# Altium schematic sheet mainboard.SchDoc
size 565 x 351 mm; Origin: Eagle
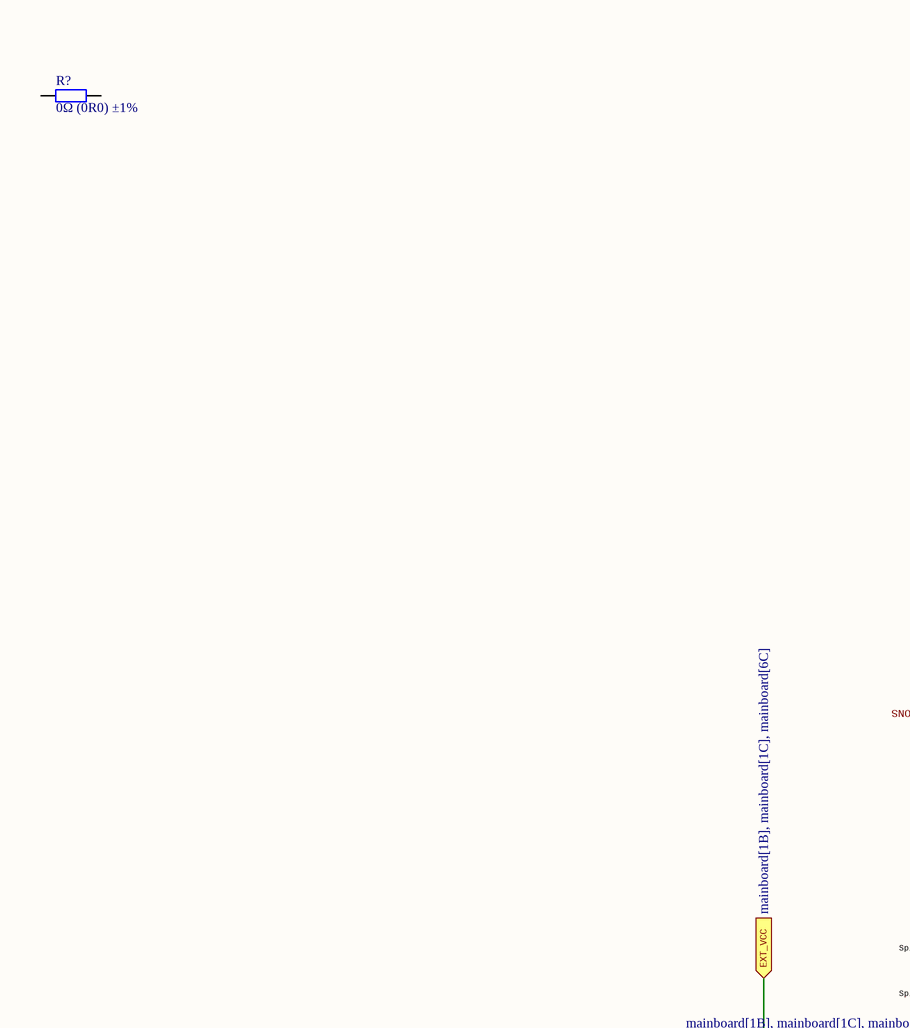
[diagram p0: mainboard.SchDoc, top left]
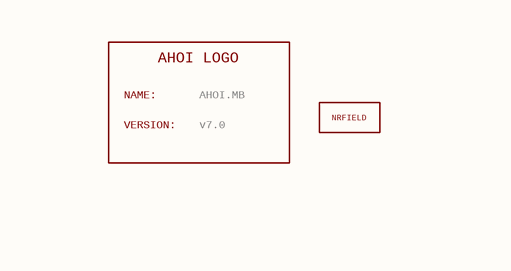
[diagram p1: mainboard.SchDoc, top middle]
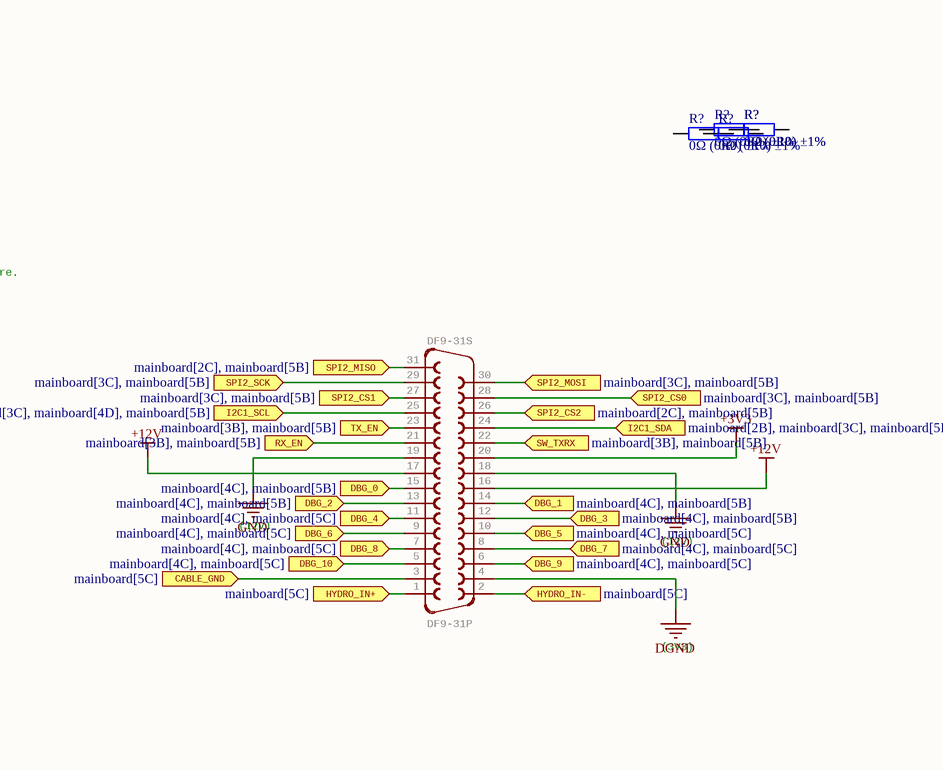
[diagram p2: mainboard.SchDoc, top right]
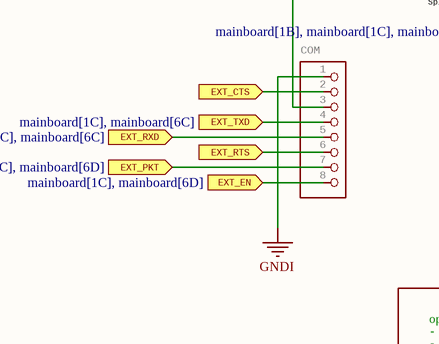
[diagram p3: mainboard.SchDoc, bottom left]
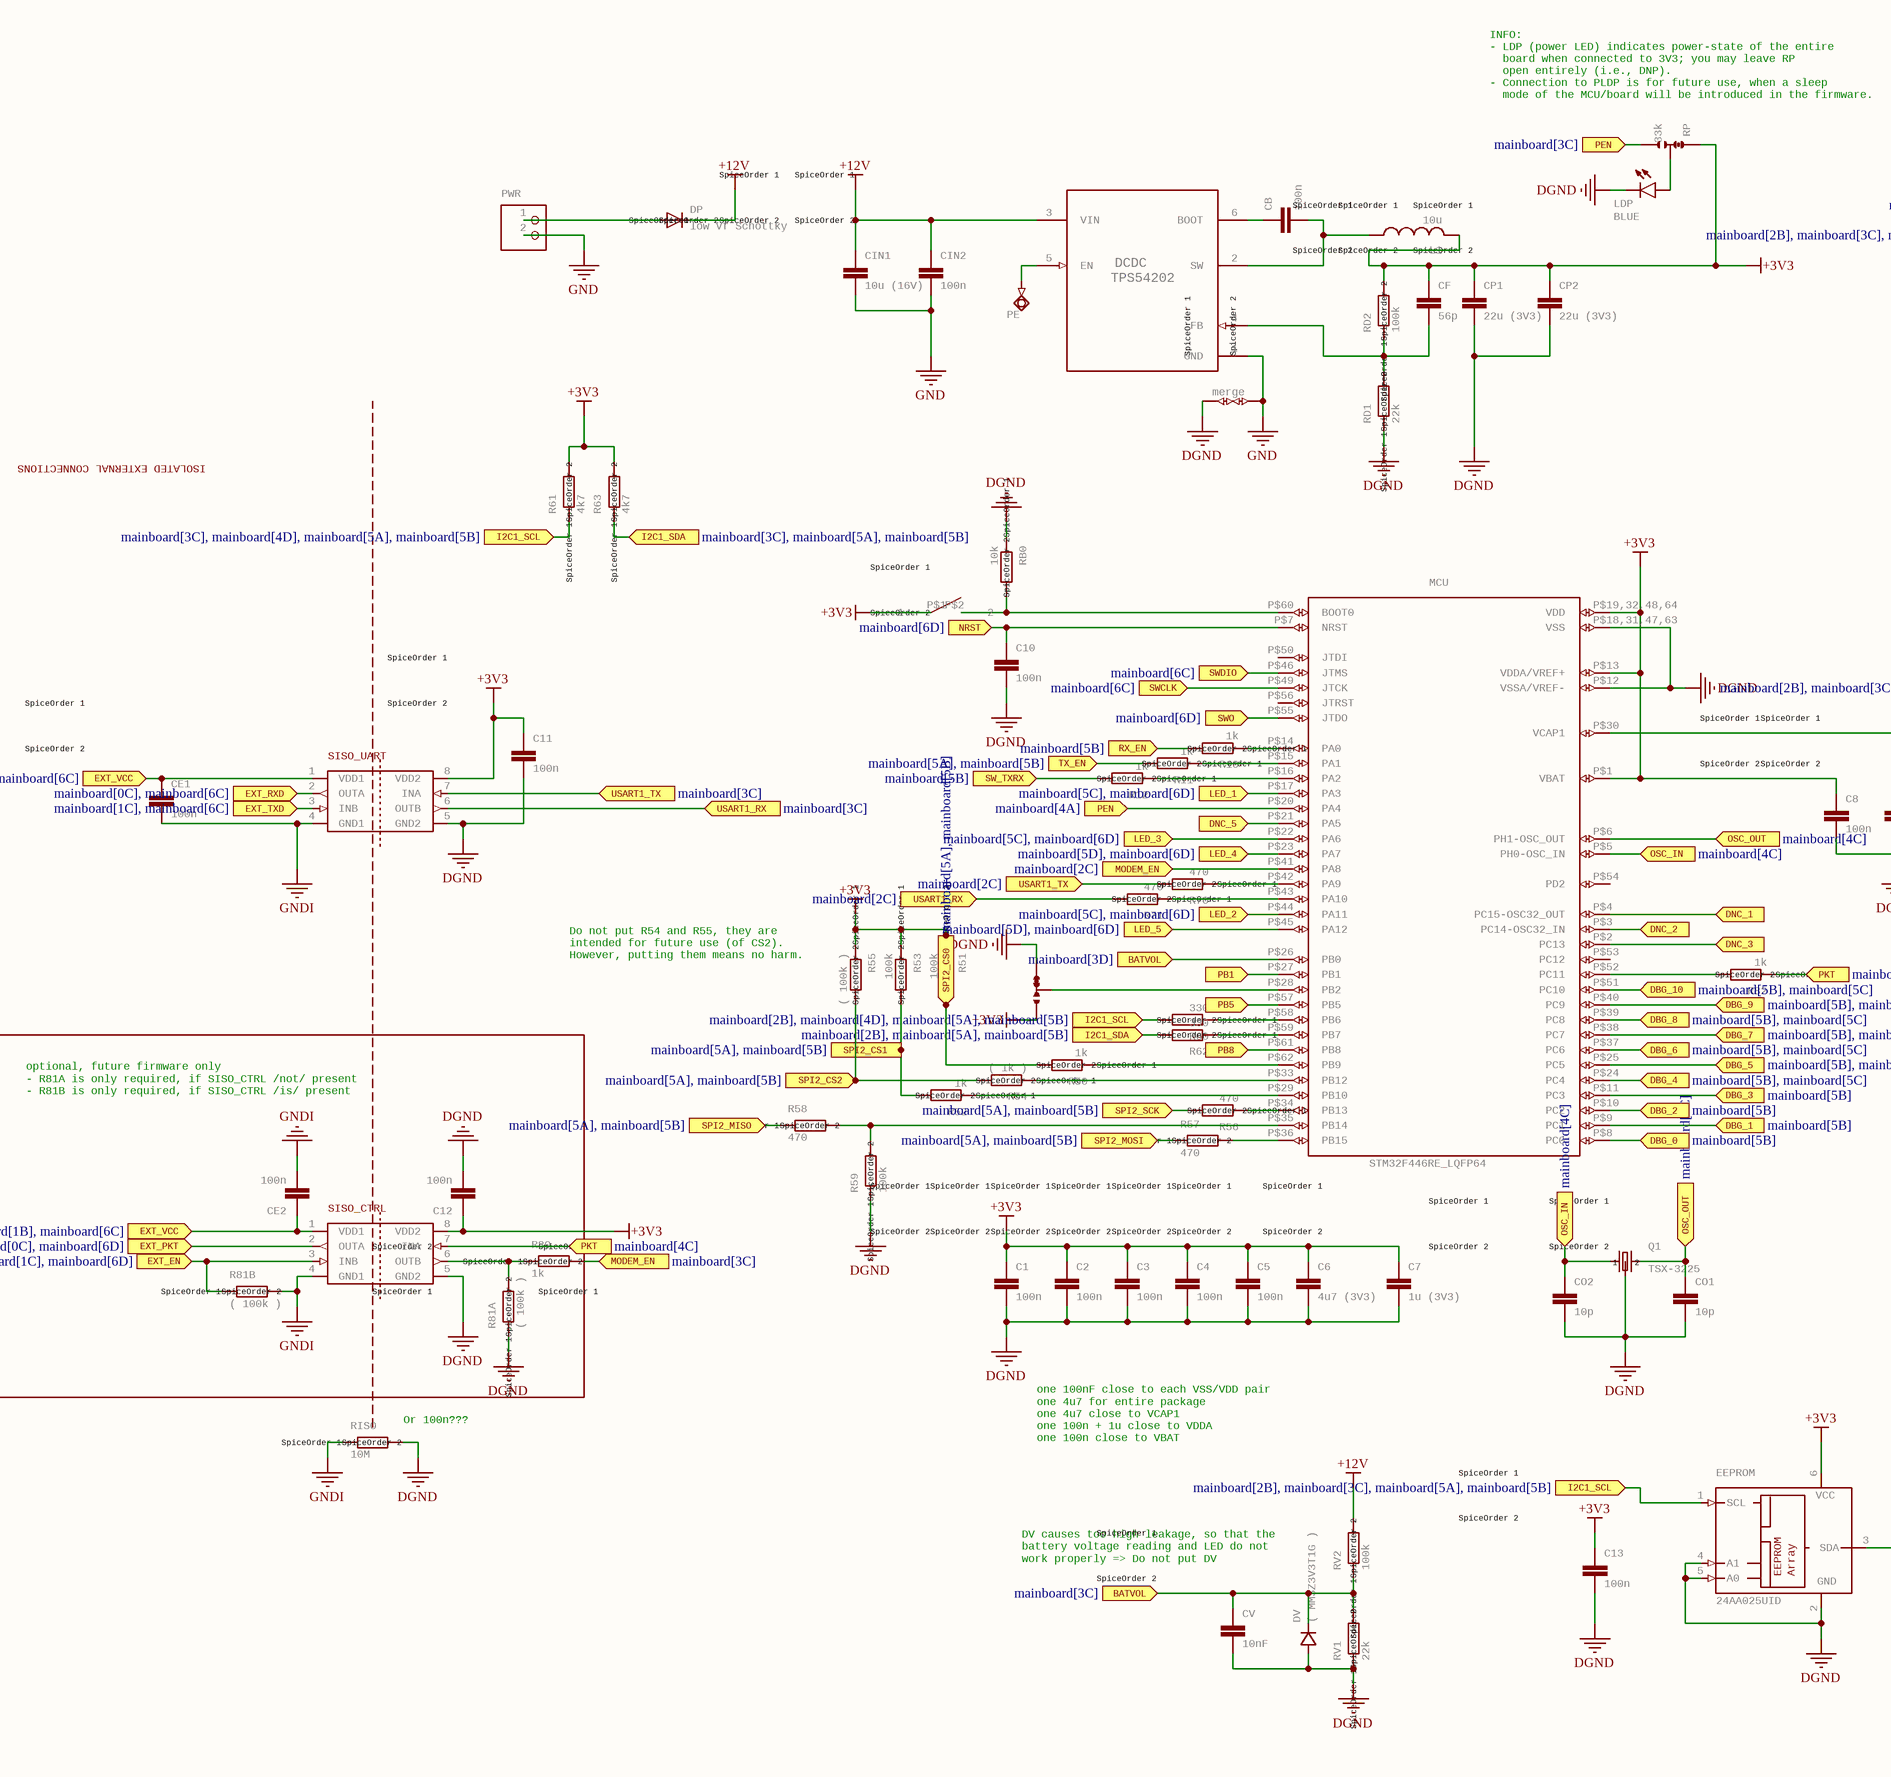
[diagram p4: mainboard.SchDoc, bottom middle]
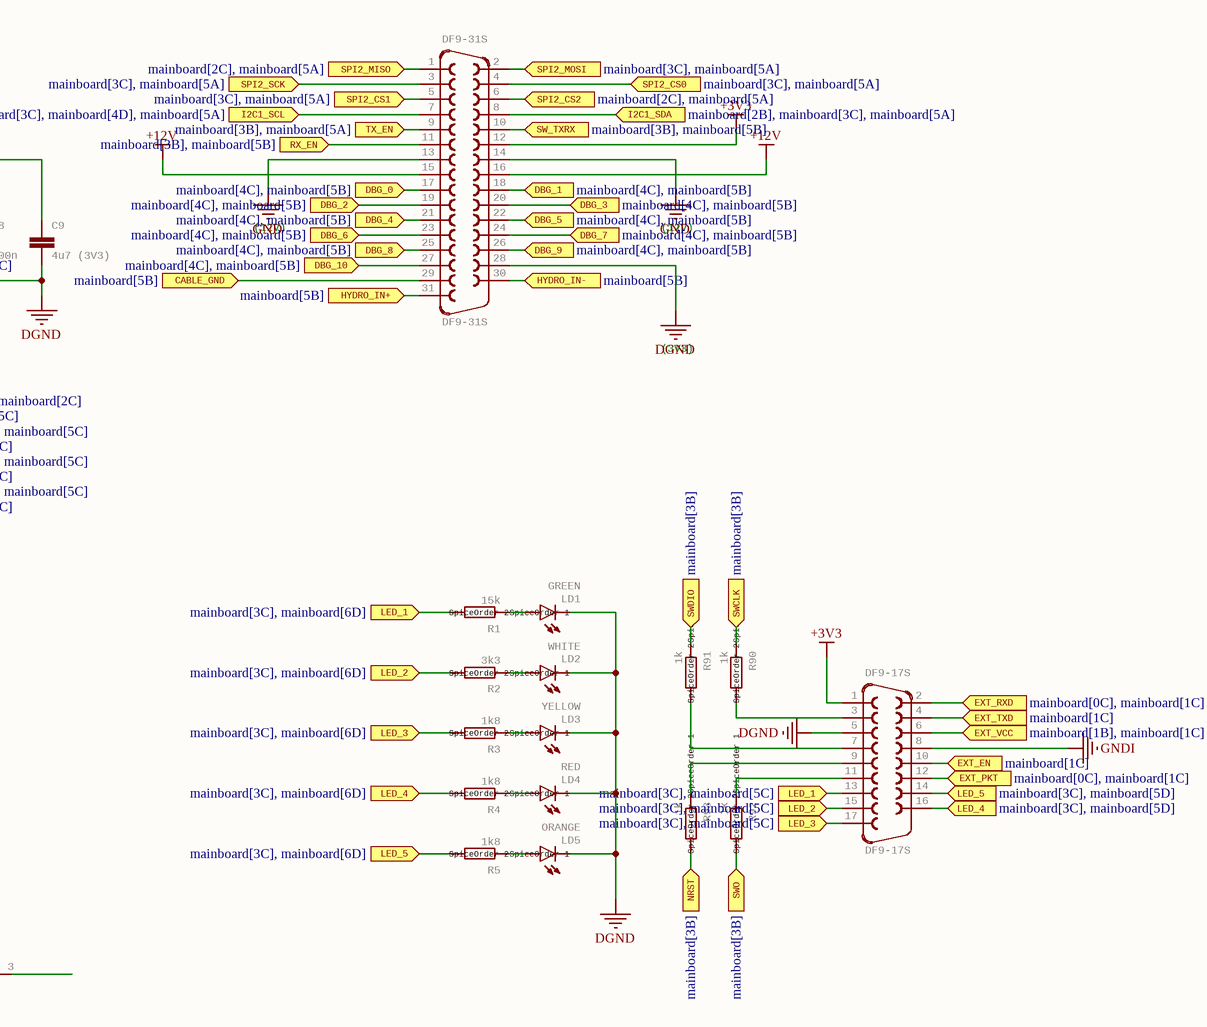
[diagram p5: mainboard.SchDoc, bottom right]

## Parts
(Parts that share a designator on the sheet are numbered #1, #2 ... from top to bottom, then left to right.)
AHOI.MB  v7.0  AHOILOGO: AHOI LOGO  NAME: NAME:  VERSION: VERSION:  [AHOI_LOGO_8MMHEIGHT]
C1  100n  SpiceOrder1: SpiceOrder 1  SpiceOrder2: SpiceOrder 2  [LC-0603_R]
C2  100n  SpiceOrder1: SpiceOrder 1  SpiceOrder2: SpiceOrder 2  [LC-0603_R]
C3  100n  SpiceOrder1: SpiceOrder 1  SpiceOrder2: SpiceOrder 2  [LC-0603_R]
C4  100n  SpiceOrder1: SpiceOrder 1  SpiceOrder2: SpiceOrder 2  [LC-0603_R]
C5  100n  SpiceOrder1: SpiceOrder 1  SpiceOrder2: SpiceOrder 2  [LC-0603_R]
C6  4u7 (3V3)  SpiceOrder1: SpiceOrder 1  SpiceOrder2: SpiceOrder 2  [LC-0805_R]
C7  1u (3V3)  SpiceOrder1: SpiceOrder 1  SpiceOrder2: SpiceOrder 2  [LC-0805_R]
C8  100n  SpiceOrder1: SpiceOrder 1  SpiceOrder2: SpiceOrder 2  [LC-0603_R]
C9  4u7 (3V3)  SpiceOrder1: SpiceOrder 1  SpiceOrder2: SpiceOrder 2  [LC-0805_R]
C10  100n  SpiceOrder1: SpiceOrder 1  SpiceOrder2: SpiceOrder 2  [LC-0603_R]
C11  100n  SpiceOrder1: SpiceOrder 1  SpiceOrder2: SpiceOrder 2  [LC-0603_R]
C12  100n  SpiceOrder1: SpiceOrder 1  SpiceOrder2: SpiceOrder 2  [LC-0603_R]
C13  100n  SpiceOrder1: SpiceOrder 1  SpiceOrder2: SpiceOrder 2  [LC-0603_R]
CB  100n  SpiceOrder1: SpiceOrder 1  SpiceOrder2: SpiceOrder 2  [LC-0603_R]
CE1  100n  SpiceOrder1: SpiceOrder 1  SpiceOrder2: SpiceOrder 2  [LC-0603_R]
CE2  100n  SpiceOrder1: SpiceOrder 1  SpiceOrder2: SpiceOrder 2  [LC-0603_R]
CF  56p  SpiceOrder1: SpiceOrder 1  SpiceOrder2: SpiceOrder 2  [LC-0603_R]
CIN1  10u (16V)  SpiceOrder1: SpiceOrder 1  SpiceOrder2: SpiceOrder 2  [LC-0805_R]
CIN2  100n  SpiceOrder1: SpiceOrder 1  SpiceOrder2: SpiceOrder 2  [LC-0603_R]
CO1  10p  SpiceOrder1: SpiceOrder 1  SpiceOrder2: SpiceOrder 2  [LC-0603_R]
CO2  10p  SpiceOrder1: SpiceOrder 1  SpiceOrder2: SpiceOrder 2  [LC-0603_R]
COM  PINHD-1X8  [1X08]  (value not drawn)
CP1  22u (3V3)  SpiceOrder1: SpiceOrder 1  SpiceOrder2: SpiceOrder 2  [LC-0805_R]
CP2  22u (3V3)  SpiceOrder1: SpiceOrder 1  SpiceOrder2: SpiceOrder 2  [LC-0805_R]
CV  10nF  SpiceOrder1: SpiceOrder 1  SpiceOrder2: SpiceOrder 2  [LC-0603_R]
DCDC  TPS54202  [LC-SOT-23-6]
DF9-17S  DF9-17S  [CONN-SMD_DF9-17S-1V-32]
DF9-31P  DF9-31S  [CONN-SMD_DF9-31S-1V]
DF9-31S  DF9-31S  [CONN-SMD_DF9-31S-1V]
DP  low Vf Schottky  SpiceOrder1: SpiceOrder 1  SpiceOrder2: SpiceOrder 2  [LC-SMA(DO-214AC)_S1]
DV  ( MM3Z3V3T1G )  [LC-SOD-323]
EEPROM  24AA025UID  [LC-SOT-23-6]
H-B1-L  0  [JMP_OR_0603]  (value not drawn)
L1  10u  [LC-SMD-3215_2P FC - 135]
LD1  GREEN  [LC-0603_LED_S1]
LD2  WHITE  [LC-0603_LED_S1]
LD3  YELLOW  [LC-0603_LED_S1]
LD4  RED  [LC-0603_LED_S1]
LD5  ORANGE  [LC-0603_LED_S1]
LDP  BLUE  [LC-0603_LED_S1]
MCU  STM32F446RE_LQFP64  [LC-LQFP-64_10x10x05P]
PE  TPSQTP06SQ  [TP06SQ]  (value not drawn)
PRG  TL3780  [SMD-SW-4_5.1x5.1x1.5]  (value not drawn)
PWR  PINHD-1X2  [1X02]  (value not drawn)
Q1  TSX-3225  [LC-SMD-3225_4P]
R1  15k  SpiceOrder1: SpiceOrder 1  SpiceOrder2: SpiceOrder 2  [LC-0603_R]
R2  3k3  SpiceOrder1: SpiceOrder 1  SpiceOrder2: SpiceOrder 2  [LC-0603_R]
R3  1k8  SpiceOrder1: SpiceOrder 1  SpiceOrder2: SpiceOrder 2  [LC-0603_R]
R4  1k8  SpiceOrder1: SpiceOrder 1  SpiceOrder2: SpiceOrder 2  [LC-0603_R]
R5  1k8  SpiceOrder1: SpiceOrder 1  SpiceOrder2: SpiceOrder 2  [LC-0603_R]
R10  1k  SpiceOrder1: SpiceOrder 1  SpiceOrder2: SpiceOrder 2  [LC-0603_R]
R11  1k  SpiceOrder1: SpiceOrder 1  SpiceOrder2: SpiceOrder 2  [LC-0603_R]
R12  1k  SpiceOrder1: SpiceOrder 1  SpiceOrder2: SpiceOrder 2  [LC-0603_R]
R50  1k  SpiceOrder1: SpiceOrder 1  SpiceOrder2: SpiceOrder 2  [LC-0603_R]
R51  100k  SpiceOrder1: SpiceOrder 1  SpiceOrder2: SpiceOrder 2  [LC-0603_R]
R52  1k  SpiceOrder1: SpiceOrder 1  SpiceOrder2: SpiceOrder 2  [LC-0603_R]
R53  100k  SpiceOrder1: SpiceOrder 1  SpiceOrder2: SpiceOrder 2  [LC-0603_R]
R54  ( 1k )  SpiceOrder1: SpiceOrder 1  SpiceOrder2: SpiceOrder 2  [LC-0603_R]
R55  ( 100k )  SpiceOrder1: SpiceOrder 1  SpiceOrder2: SpiceOrder 2  [LC-0603_R]
R56  470  SpiceOrder1: SpiceOrder 1  SpiceOrder2: SpiceOrder 2  [LC-0603_R]
R57  470  SpiceOrder1: SpiceOrder 1  SpiceOrder2: SpiceOrder 2  [LC-0603_R]
R58  470  SpiceOrder1: SpiceOrder 1  SpiceOrder2: SpiceOrder 2  [LC-0603_R]
R59  100k  SpiceOrder1: SpiceOrder 1  SpiceOrder2: SpiceOrder 2  [LC-0603_R]
R60  330  SpiceOrder1: SpiceOrder 1  SpiceOrder2: SpiceOrder 2  [LC-0603_R]
R61  4k7  SpiceOrder1: SpiceOrder 1  SpiceOrder2: SpiceOrder 2  [LC-0603_R]
R62  330  SpiceOrder1: SpiceOrder 1  SpiceOrder2: SpiceOrder 2  [LC-0603_R]
R63  4k7  SpiceOrder1: SpiceOrder 1  SpiceOrder2: SpiceOrder 2  [LC-0603_R]
R70  470  SpiceOrder1: SpiceOrder 1  SpiceOrder2: SpiceOrder 2  [LC-0603_R]
R71  470  SpiceOrder1: SpiceOrder 1  SpiceOrder2: SpiceOrder 2  [LC-0603_R]
R80  1k  SpiceOrder1: SpiceOrder 1  SpiceOrder2: SpiceOrder 2  [LC-0603_R]
R81A  ( 100k )  SpiceOrder1: SpiceOrder 1  SpiceOrder2: SpiceOrder 2  [LC-0603_R]
R81B  ( 100k )  SpiceOrder1: SpiceOrder 1  SpiceOrder2: SpiceOrder 2  [LC-0603_R]
R82  1k  SpiceOrder1: SpiceOrder 1  SpiceOrder2: SpiceOrder 2  [LC-0603_R]
R90  1k  SpiceOrder1: SpiceOrder 1  SpiceOrder2: SpiceOrder 2  [LC-0603_R]
R91  1k  SpiceOrder1: SpiceOrder 1  SpiceOrder2: SpiceOrder 2  [LC-0603_R]
R92  1k  SpiceOrder1: SpiceOrder 1  SpiceOrder2: SpiceOrder 2  [LC-0603_R]
R93  1k  SpiceOrder1: SpiceOrder 1  SpiceOrder2: SpiceOrder 2  [LC-0603_R]
R?#1  0Ω (0R0) ±1%  [0402_R]
R?#2  0Ω (0R0) ±1%  [0402_R]
R?#3  0Ω (0R0) ±1%  [0402_R]
R?#4  0Ω (0R0) ±1%  [0402_R]
R?#5  0Ω (0R0) ±1%  [0402_R]
R?#6  0Ω (0R0) ±1%  [0402_R]
RB0  10k  SpiceOrder1: SpiceOrder 1  SpiceOrder2: SpiceOrder 2  [LC-0603_R]
RD1  22k  SpiceOrder1: SpiceOrder 1  SpiceOrder2: SpiceOrder 2  [LC-0603_R]
RD2  100k  SpiceOrder1: SpiceOrder 1  SpiceOrder2: SpiceOrder 2  [LC-0603_R]
RISO  10M  SpiceOrder1: SpiceOrder 1  SpiceOrder2: SpiceOrder 2  [LC-0603_R]
RP  33k  [JMP_OR_0603]
RV1  22k  SpiceOrder1: SpiceOrder 1  SpiceOrder2: SpiceOrder 2  [LC-0603_R]
RV2  100k  SpiceOrder1: SpiceOrder 1  SpiceOrder2: SpiceOrder 2  [LC-0603_R]
SISO_CTRL  ISO7021F  [LC-SOP-8_150mil]  (value not drawn)
SISO_UART  ISO7021  [LC-SOP-8_150mil]  (value not drawn)
U$1  NR_FIELD  [NR_FIELD]  (value not drawn)
U$2  GND_MERGE  [GND_MERGE]  (value not drawn)

## Ports
BATVOL (in, see mainboard[3C]), BATVOL (in, see mainboard[3D]), CABLE_GND (in, see mainboard[5B]), CABLE_GND (in, see mainboard[5C]), DBG_0 (in, see mainboard[4C], mainboard[5B]), DBG_0 (in, see mainboard[5B]), DBG_1 (in, see mainboard[4C], mainboard[5B]), DBG_1 (in, see mainboard[5B]), DBG_2 (in, see mainboard[4C], mainboard[5B]), DBG_2 (in, see mainboard[5B]), DBG_3 (in, see mainboard[4C], mainboard[5B]), DBG_3 (in, see mainboard[5B]), DBG_4 (in, see mainboard[4C], mainboard[5B]), DBG_4 (in, see mainboard[4C], mainboard[5C]), DBG_4 (in, see mainboard[5B], mainboard[5C]), DBG_5 (in, see mainboard[4C], mainboard[5B]), DBG_5 (in, see mainboard[4C], mainboard[5C]), DBG_5 (in, see mainboard[5B], mainboard[5C]), DBG_6 (in, see mainboard[4C], mainboard[5B]), DBG_6 (in, see mainboard[4C], mainboard[5C]), DBG_6 (in, see mainboard[5B], mainboard[5C]), DBG_7 (in, see mainboard[4C], mainboard[5B]), DBG_7 (in, see mainboard[4C], mainboard[5C]), DBG_7 (in, see mainboard[5B], mainboard[5C]), DBG_8 (in, see mainboard[4C], mainboard[5B]), DBG_8 (in, see mainboard[4C], mainboard[5C]), DBG_8 (in, see mainboard[5B], mainboard[5C]), DBG_9 (in, see mainboard[4C], mainboard[5B]), DBG_9 (in, see mainboard[4C], mainboard[5C]), DBG_9 (in, see mainboard[5B], mainboard[5C]), DBG_10 (in, see mainboard[4C], mainboard[5B]), DBG_10 (in, see mainboard[4C], mainboard[5C]), DBG_10 (in, see mainboard[5B], mainboard[5C]), DNC_1 (in), DNC_2 (in), DNC_3 (in), DNC_5 (in), EXT_CTS (in), EXT_EN (in, see mainboard[1C]), EXT_EN (in, see mainboard[1C], mainboard[6D]), EXT_PKT (in, see mainboard[0C], mainboard[1C]), EXT_PKT (in, see mainboard[0C], mainboard[6D]), EXT_PKT (in, see mainboard[1C], mainboard[6D]), EXT_RTS (in), EXT_RXD (in, see mainboard[0C], mainboard[1C]), EXT_RXD (in, see mainboard[0C], mainboard[6C]), EXT_RXD (in, see mainboard[1C], mainboard[6C]), EXT_TXD (in, see mainboard[1C]), EXT_TXD (in, see mainboard[1C], mainboard[6C]), EXT_VCC (in, see mainboard[1B], mainboard[1C]), EXT_VCC (in, see mainboard[1B], mainboard[1C], mainboard[6C]), EXT_VCC (in, see mainboard[1B], mainboard[6C]), HYDRO_IN+ (in, see mainboard[5B]), HYDRO_IN+ (in, see mainboard[5C]), HYDRO_IN- (in, see mainboard[5B]), HYDRO_IN- (in, see mainboard[5C]), I2C1_SCL (in, see mainboard[2B], mainboard[3C], mainboard[4D], mainboard[5A]), I2C1_SCL (in, see mainboard[2B], mainboard[3C], mainboard[4D], mainboard[5B]), I2C1_SCL (in, see mainboard[2B], mainboard[3C], mainboard[5A], mainboard[5B]), I2C1_SCL (in, see mainboard[2B], mainboard[4D], mainboard[5A], mainboard[5B]), I2C1_SCL (in, see mainboard[3C], mainboard[4D], mainboard[5A], mainboard[5B]), I2C1_SDA (in, see mainboard[2B], mainboard[3C], mainboard[5A]), I2C1_SDA (in, see mainboard[2B], mainboard[3C], mainboard[5B]), I2C1_SDA (in, see mainboard[2B], mainboard[5A], mainboard[5B]), I2C1_SDA (in, see mainboard[3C], mainboard[5A], mainboard[5B]), LED_1 (in, see mainboard[3C], mainboard[5C]), LED_1 (in, see mainboard[3C], mainboard[6D]), LED_1 (in, see mainboard[5C], mainboard[6D]), LED_2 (in, see mainboard[3C], mainboard[5C]), LED_2 (in, see mainboard[3C], mainboard[6D]), LED_2 (in, see mainboard[5C], mainboard[6D]), LED_3 (in, see mainboard[3C], mainboard[5C]), LED_3 (in, see mainboard[3C], mainboard[6D]), LED_3 (in, see mainboard[5C], mainboard[6D]), LED_4 (in, see mainboard[3C], mainboard[5D]), LED_4 (in, see mainboard[3C], mainboard[6D]), LED_4 (in, see mainboard[5D], mainboard[6D]), LED_5 (in, see mainboard[3C], mainboard[5D]), LED_5 (in, see mainboard[3C], mainboard[6D]), LED_5 (in, see mainboard[5D], mainboard[6D]), MODEM_EN (in, see mainboard[2C]), MODEM_EN (in, see mainboard[3C]), NRST (in, see mainboard[3B]), NRST (in, see mainboard[6D]), OSC_IN (in, see mainboard[4C]), OSC_OUT (in, see mainboard[4C]), PB1 (in), PB5 (in), PB8 (in), PEN (in, see mainboard[3C]), PEN (in, see mainboard[4A]), PKT (in, see mainboard[2C]), PKT (in, see mainboard[4C]), RX_EN (in, see mainboard[3B], mainboard[5B]), RX_EN (in, see mainboard[5B]), SPI2_CS0 (in, see mainboard[3C], mainboard[5A]), SPI2_CS0 (in, see mainboard[3C], mainboard[5B]), SPI2_CS0 (in, see mainboard[5A], mainboard[5B]), SPI2_CS1 (in, see mainboard[3C], mainboard[5A]), SPI2_CS1 (in, see mainboard[3C], mainboard[5B]), SPI2_CS1 (in, see mainboard[5A], mainboard[5B]), SPI2_CS2 (in, see mainboard[2C], mainboard[5A]), SPI2_CS2 (in, see mainboard[2C], mainboard[5B]), SPI2_CS2 (in, see mainboard[5A], mainboard[5B]), SPI2_MISO (in, see mainboard[2C], mainboard[5A]), SPI2_MISO (in, see mainboard[2C], mainboard[5B]), SPI2_MISO (in, see mainboard[5A], mainboard[5B]), SPI2_MOSI (in, see mainboard[3C], mainboard[5A]), SPI2_MOSI (in, see mainboard[3C], mainboard[5B]), SPI2_MOSI (in, see mainboard[5A], mainboard[5B]), SPI2_SCK (in, see mainboard[3C], mainboard[5A]), SPI2_SCK (in, see mainboard[3C], mainboard[5B]), SPI2_SCK (in, see mainboard[5A], mainboard[5B]), SW_TXRX (in, see mainboard[3B], mainboard[5B]), SW_TXRX (in, see mainboard[5B]), SWCLK (in, see mainboard[3B]), SWCLK (in, see mainboard[6C]), SWDIO (in, see mainboard[3B]), SWDIO (in, see mainboard[6C]), SWO (in, see mainboard[3B]), SWO (in, see mainboard[6D]), TX_EN (in, see mainboard[3B], mainboard[5A]), TX_EN (in, see mainboard[3B], mainboard[5B]), TX_EN (in, see mainboard[5A], mainboard[5B]), USART1_RX (in, see mainboard[2C]), USART1_RX (in, see mainboard[3C]), USART1_TX (in, see mainboard[2C]), USART1_TX (in, see mainboard[3C])

## Nets
+3V3: C1.1 C2.1 C3.1 C4.1 C5.1 C6.1 C7.1 C8.1 C11.1 C12.1 C13.1 CF.1 CP1.1 CP2.1 DF9-17S.1 DF9-31P.20 DF9-31P.28 DF9-31S.4 DF9-31S.12 EEPROM.6(VCC) H-B1-L.3 L1.2 MCU.P$1(VBAT) MCU.P$13(VDDA/VREF+) MCU.P$19,32,48,64(VDD) PRG.P$1(1) R50.2 R51.1 R51.2 R53.1 R55.1 R61.2 R63.2 RD2.2 RP.1 SISO_CTRL.8(VDD2) SISO_UART.8(VDD2) ; port SPI2_CS0
+12V: CIN1.1 CIN2.1 DCDC.3(VIN) DF9-31P.16 DF9-31P.17 DF9-31S.15 DF9-31S.16 DP.C RV2.2
DGND: C1.2 C2.2 C3.2 C4.2 C5.2 C6.2 C7.2 C8.2 C9.2 C10.2 C11.2 C12.2 C13.2 CO1.2 CO2.2 CP1.2 CP2.2 CV.2 DF9-17S.5 DF9-31P.4 DF9-31S.28 DV.2(A) EEPROM.2(GND) EEPROM.4(A1) EEPROM.5(A0) H-B1-L.1 LD1.2(C) LD2.2(C) LD3.2(C) LD4.2(C) LD5.2(C) LDP.2(C) MCU.P$12(VSSA/VREF-) MCU.P$18,31,47,63(VSS) Q1.2,4(P$1) R59.1 R81A.1 RB0.1 RD1.1 RISO.2 RV1.1 SISO_CTRL.5(GND2) SISO_UART.5(GND2) U$2.P$1
GND: CIN1.2 CIN2.2 DCDC.1(GND) DF9-31P.18 DF9-31P.19 DF9-31S.13 DF9-31S.14 PWR.2 U$2.P$2
GNDI: CE1.2 CE2.2 COM.1 DF9-17S.8 R81B.2 RISO.1 SISO_CTRL.4(GND1) SISO_UART.4(GND1)
BATVOL: CV.1 DV.1(C) MCU.P$26(PB0) RV1.2 RV2.1 ; port BATVOL
CABLE_GND: DF9-31P.3 DF9-31S.29 ; port CABLE_GND
DBG_0: DF9-31P.15 DF9-31S.17 MCU.P$8(PC0) ; port DBG_0
DBG_1: DF9-31P.14 DF9-31S.18 MCU.P$9(PC1) ; port DBG_1
DBG_2: DF9-31P.13 DF9-31S.19 MCU.P$10(PC2) ; port DBG_2
DBG_3: DF9-31P.12 DF9-31S.20 MCU.P$11(PC3) ; port DBG_3
DBG_4: DF9-31P.11 DF9-31S.21 MCU.P$24(PC4) ; port DBG_4
DBG_5: DF9-31P.10 DF9-31S.22 MCU.P$25(PC5) ; port DBG_5
DBG_6: DF9-31P.9 DF9-31S.23 MCU.P$37(PC6) ; port DBG_6
DBG_7: DF9-31P.8 DF9-31S.24 MCU.P$38(PC7) ; port DBG_7
DBG_8: DF9-31P.7 DF9-31S.25 MCU.P$39(PC8) ; port DBG_8
DBG_9: DF9-31P.6 DF9-31S.26 MCU.P$40(PC9) ; port DBG_9
DBG_10: DF9-31P.5 DF9-31S.27 MCU.P$51(PC10) ; port DBG_10
DNC_1: MCU.P$4(PC15-OSC32_OUT) ; port DNC_1
DNC_2: MCU.P$3(PC14-OSC32_IN) ; port DNC_2
DNC_3: MCU.P$2(PC13) ; port DNC_3
DNC_5: MCU.P$21(PA5) ; port DNC_5
EXT_CTS: COM.2 ; port EXT_CTS
EXT_EN: COM.8 DF9-17S.10 R81B.1 SISO_CTRL.3(INB) ; port EXT_EN
EXT_PKT: COM.7 DF9-17S.12 SISO_CTRL.2(OUTA) ; port EXT_PKT
EXT_RTS: COM.6 ; port EXT_RTS
EXT_RXD: COM.5 DF9-17S.2 SISO_UART.2(OUTA) ; port EXT_RXD
EXT_TXD: COM.4 DF9-17S.4 SISO_UART.3(INB) ; port EXT_TXD
EXT_VCC: CE1.1 CE2.1 COM.3 DF9-17S.6 SISO_CTRL.1(VDD1) SISO_UART.1(VDD1) ; port EXT_VCC
HYDRO_IN+: DF9-31P.1 DF9-31S.31 ; port HYDRO_IN+
HYDRO_IN-: DF9-31P.2 DF9-31S.30 ; port HYDRO_IN-
I2C1_SCL: DF9-31P.25 DF9-31S.7 EEPROM.1(SCL) R60.2 R61.1 ; port I2C1_SCL
I2C1_SDA: DF9-31P.24 DF9-31S.8 R62.2 R63.1 ; port I2C1_SDA
LED_1: DF9-17S.13 MCU.P$17(PA3) R1.2 ; port LED_1
LED_2: DF9-17S.15 MCU.P$44(PA11) R2.2 ; port LED_2
LED_3: DF9-17S.17 MCU.P$22(PA6) R3.2 ; port LED_3
LED_4: DF9-17S.16 MCU.P$23(PA7) R4.2 ; port LED_4
LED_5: DF9-17S.14 MCU.P$45(PA12) R5.2 ; port LED_5
MODEM_EN: MCU.P$41(PA8) R80.2 ; port MODEM_EN
NRST: C10.1 MCU.P$7(NRST) R93.2 ; port NRST
OSC_IN: CO2.1 MCU.P$5(PH0-OSC_IN) Q1.1 ; port OSC_IN
OSC_OUT: CO1.1 MCU.P$6(PH1-OSC_OUT) Q1.3 ; port OSC_OUT
PB1: MCU.P$27(PB1) ; port PB1
PB5: MCU.P$57(PB5) ; port PB5
PB8: MCU.P$61(PB8) ; port PB8
PEN: MCU.P$20(PA4) RP.3 ; port PEN
PKT: R82.1 SISO_CTRL.7(INA) ; port PKT
RX_EN: DF9-31P.21 DF9-31S.11 R10.2 ; port RX_EN
SPI2_CS1: DF9-31P.27 DF9-31S.5 R52.2 R53.2 ; port SPI2_CS1
SPI2_CS2: DF9-31P.26 DF9-31S.6 R54.2 R55.2 ; port SPI2_CS2
SPI2_MISO: DF9-31P.31 DF9-31S.1 R58.1 ; port SPI2_MISO
SPI2_MOSI: DF9-31P.30 DF9-31S.2 R57.1 ; port SPI2_MOSI
SPI2_SCK: DF9-31P.29 DF9-31S.3 R56.2 ; port SPI2_SCK
SW_TXRX: DF9-31P.22 DF9-31S.10 R12.2 ; port SW_TXRX
SWCLK: MCU.P$49(JTCK) R90.1 ; port SWCLK
SWDIO: MCU.P$46(JTMS) R91.1 ; port SWDIO
SWO: MCU.P$55(JTDO) R92.2 ; port SWO
TX_EN: DF9-31P.23 DF9-31S.9 R11.2 ; port TX_EN
USART1_RX: R71.2 SISO_UART.6(OUTB) ; port USART1_RX
USART1_TX: R70.2 SISO_UART.7(INA) ; port USART1_TX
NetC9_1: C9.1 MCU.P$30(VCAP1)
NetCB_1: CB.1 DCDC.6(BOOT)
NetCB_2: CB.2 DCDC.2(SW) L1.1
NetCF_2: CF.2 DCDC.4(FB) RD1.2 RD2.1
NetDCDC_5: DCDC.5(EN) PE.TP
NetDF9-17S_3: DF9-17S.3 R90.2
NetDF9-17S_7: DF9-17S.7 R91.2
NetDF9-17S_9: DF9-17S.9 R93.1
NetDF9-17S_11: DF9-17S.11 R92.1
NetDP_A: DP.A PWR.1
NetH-B1-L_2: H-B1-L.2 MCU.P$28(PB2)
NetLD1_1: LD1.1(A) R1.1
NetLD2_1: LD2.1(A) R2.1
NetLD3_1: LD3.1(A) R3.1
NetLD4_1: LD4.1(A) R4.1
NetLD5_1: LD5.1(A) R5.1
NetLDP_1: LDP.1(A) RP.2
NetMCU_P$14: MCU.P$14(PA0) R10.1
NetMCU_P$15: MCU.P$15(PA1) R11.1
NetMCU_P$16: MCU.P$16(PA2) R12.1
NetMCU_P$29: MCU.P$29(PB10) R52.1
NetMCU_P$33: MCU.P$33(PB12) R54.1
NetMCU_P$34: MCU.P$34(PB13) R56.1
NetMCU_P$35: MCU.P$35(PB14) R58.2 R59.2
NetMCU_P$36: MCU.P$36(PB15) R57.2
NetMCU_P$42: MCU.P$42(PA9) R70.1
NetMCU_P$43: MCU.P$43(PA10) R71.1
NetMCU_P$52: MCU.P$52(PC11) R82.2
NetMCU_P$58: MCU.P$58(PB6) R60.1
NetMCU_P$59: MCU.P$59(PB7) R62.1
NetMCU_P$60: MCU.P$60(BOOT0) PRG.P$2(2) RB0.2
NetMCU_P$62: MCU.P$62(PB9) R50.1
NetR80_1: R80.1 R81A.2 SISO_CTRL.6(OUTB)
NetR?#3_1: R?#3.1 R?#4.1
NetR?#3_2: R?#3.2 R?#4.2

Not connected (* = marked no-connect by the designer): EEPROM 3(SDA); MCU P$50(JTDI) P$53(PC12) P$54(PD2) P$56(JTRST); R?#1 1 2; R?#2 1 2; R?#5 1 2; R?#6 1 2

## Notes on the sheet
- (near RP) INFO:
  - LDP (power LED) indicates power-state of the entire
  board when connected to 3V3; you may leave RP
  open entirely (i.e., DNP).
  - Connection to PLDP is for future use, when a sleep
  mode of the MCU/board will be introduced in the firmware.
- (12V)
- ISOLATED EXTERNAL CONNECTIONS
- (3V3)
- (near R55) Do not put R54 and R55, they are
  intended for future use (of CS2).
  However, putting them means no harm.
- optional, future firmware only
  - R81A is only required, if SISO_CTRL /not/ present
  - R81B is only required, if SISO_CTRL /is/ present
- (near RISO) Or 100n???
- one 100nF close to each VSS/VDD pair
  one 4u7 for entire package
  one 4u7 close to VCAP1
  one 100n + 1u close to VDDA
  one 100n close to VBAT
- (near RV2) DV causes too high leakage, so that the
  battery voltage reading and LED do not
  work properly => Do not put DV

## Library data of the parts
AHOI.MB = AHOI_LOGO: GateName_1: G$1; SymbolName_1: AHOI_LOGO; LibraryName: logo; DeviceSetName: AHOI_LOGO
C1-C5 C8 C10-C13 CB CE1 CE2 CF CIN2 CO1 CO2 CV = CC0603: GateName_1: G$1; SymbolName_1: C; DeviceName: C0603; LibraryName: myrcl; DeviceSetName: C
C6 C7 C9 CIN1 CP1 CP2 = CC0805: GateName_1: G$1; SymbolName_1: C; DeviceName: C0805; LibraryName: myrcl; DeviceSetName: C
COM = PINHD-1X8: PIN HEADER; GateName_1: A; SymbolName_1: PINHD8; POPULARITY: 67; LibraryName: pinhead; DeviceSetName: PINHD-1X8
DCDC = TPS54202: PARTNUMBER: TPS54202DDCR; GateName_1: A; SymbolName_1: TPS54202DDC; LibraryName: tps54202; DeviceSetName: TPS54202; MOUNTTYPE: SMT
DF9-17S = DF9-17S: GateName_1: G$1; SymbolName_1: DF9-17S; LibraryName: con-hirose; DeviceSetName: DF9-17S
DF9-31P DF9-31S = DF9-31S: SMD CONNECTOR   Source: con-hirose.lbr from Bob Starr <rtzaudio@mindspring.com>; MPN: DF9-31S-1V(32); GateName_1: DF9; SymbolName_1: DF9-31S; LibraryName: con-hirose; DeviceSetName: DF9-31S; MF: MF; OC_FARNELL: 1798382; OC_NEWARK: 74R3383
DP = DIODE-DO-214AC: DIODE; GateName_1: G$1; SymbolName_1: D; DeviceSetName: DIODE-; DeviceName: DO-214AC; LibraryName: diode
DV = DSOD323: DIODE; MPN: CDSOD323-T05C; GateName_1: G$1; DeviceName: SOD323; DeviceSetName: D; POPULARITY: 0; SymbolName_1: DIODE; LibraryName: zetex; MF: MF; OC_FARNELL: 1824860; OC_NEWARK: 79R6078
EEPROM = 24AA025UID: GateName_1: G$1; SymbolName_1: 24AA; LibraryName: 24AA02UID; DeviceSetName: 24AA025UID; Array: Array; VCC: VCC; GND: GND; EEPROM: EEPROM
H-B1-L RP = JMP_0603S: GateName_1: G$1; SymbolName_1: JMP_OR; DeviceName: S; LibraryName: jmp-or-0603; DeviceSetName: JMP_0603
L1 = VLCF5028-2: GateName_1: G$1; SymbolName_1: L-US; LibraryName: VLCF5028; DeviceSetName: VLCF5028-2
LD1-LD5 LDP = LED0603: GateName_1: G$1; SymbolName_1: LED; LibraryName: myrcl; DeviceSetName: LED0603
MCU = STM32F446RE_LQFP64: pin to pad: P$18,31,47,63>P$18+31+47+63 P$19,32,48,64>P$19+32+48+64; GateName_1: G$1; SymbolName_1: STM32F446RE; LibraryName: stm32f446re; DeviceSetName: STM32F446RE_LQFP64
PE = TPSQTP06SQ: Test pad; GateName_1: G$1; SymbolName_1: PPAD; DeviceSetName: TPSQ; POPULARITY: 0; DeviceName: TP06SQ; LibraryName: testpad
PRG = TL3780: GateName_1: G$1; SymbolName_1: BUTTON; LibraryName: switch-tl3780; DeviceSetName: TL3780
PWR = PINHD-1X2: PIN HEADER; GateName_1: G$1; SymbolName_1: PINHD2; LibraryName: pinhead; DeviceSetName: PINHD-1X2
Q1 = KX-7: Quartz Crystals (MHz) SMD: KX - Serie                  	                 Model    	          Size l/w/h [mm]    	          Frequency Range    	          Frequency       Stability    	          Temp. Range [掳C]     	          Load       Capacitance    	          AECQ 200       availabel    	          Datasheet    	                 KX-4       KX-5       KX-6       KX-7       KX-9A       KX-9B       KX-12A       KX-12B       KX-13       KX-20       KX-K       KX-KS      	          1.6/1.2/0.3       2.0/1.6/0.45       2.5/2.0/0.55       3.2/2.5/0.8       5.0/3.2/1.0        5.0/3.2/1.1        6.0/3.5/1.1        6.0/3.5/1.0        7.0/5.0 /1.3        11.6/5.5/1.6        12.3/4.5/4.2        12.3/4.5/3.2      	          24.0 ~ 80.0 MHz       16.0 ~ 80.0 MHz       12.0 ~ 80.0 MHz       8.0 ~ 60.0 MHz       7,68 ~ 300,0 MHz       8,0 ~ 50,0 MHz       8,0 ~ 150,0 MHz       8,0 ~ 50,0 MHz       6,0 ~ 160,0 MHz       3,579 ~ 25,0 MHz       3,579 ~ 70,0 MHz       3,579 ~ 70,0 MHz     	          卤10 鈥?卤50ppm       卤10 鈥?卤50ppm       卤10 鈥?卤50ppm       卤10 鈥?卤50ppm       卤10 鈥?卤50ppm       卤10 鈥?卤50ppm       卤10 鈥?卤50ppm       卤10 鈥?卤50ppm       卤10 鈥?卤50ppm       卤50ppm       卤10 鈥?卤50ppm       卤10 鈥?卤50ppm     	         (*) -40掳C 鈥?85掳C      (*) -40掳C 鈥?125掳C      (*) -40掳C 鈥?125掳C      (*) -40掳C 鈥?125掳C      (*) -40掳C 鈥?105掳C      (*) -40掳C 鈥?105掳C      (*) -40掳C 鈥?125掳C      (*) -40掳C 鈥?105掳C      (*) -40掳C 鈥?105掳C      (*) -40掳C 鈥?105掳C      (*) -40掳C 鈥?85掳C      (*) -40掳C 鈥?85掳C     	          8, 8鈥?6       8, 8鈥?6       10, 8鈥?6       12, 7鈥?0       16, 10鈥?0       16, 10鈥?0       16, 10鈥?0       16, 12鈥?0       16, 12鈥?0       16, 12鈥?0       16, 12鈥?0       16, 12鈥?0     	         -      yes       yes     yes       -       -       -       -       -       -       -       -     	          KX-4.pdf       KX-5.pdf       KX-6.pdf       KX-7.pdf       KX-9A.pdf       KX-9B.pdf       KX-12A.pdf       KX-12B.pdf       KX-13.pdf       KX-20.pdf       KX-K.pdf       KX-KS.pdf     	  	       Details see: http://www.geyer-electronic.de/Frequenz-Produkte.9.0.html   Created 2016-06-07, Hans Locher 2016 (C) Geyer Quartz Technology   KX4,KX5,KX6,KX7,KX9A,KX9B,KX12A,KX12B,KX13,KX20,KXK,KXKS;1612;2016;2520;3225;5032;6035;7050;11655;12345;1,6x1,2;2,0x1,6;2,5x2,0;3,2x2,5;5,0x3,2;6,0x3,5;7,0x5,0;11,6x5,5;12,3x4,5;12,3x4,5;1.6x1.2;2.0x1.6;2.5x2.0;3.2x2.5;5.0x3.2;6.0x3.5;7.0x5.0;11.6x5.5;12.3x4.5;12.3x4.5;; pin to pad: 2,4>2+4; GateName_1: G$1; SymbolName_1: Q; DeviceName: -7; LibraryName: crystal-geyer_V1_0; DeviceSetName: KX; 1: 1; 2: 2
R1-R5 R10-R12 R50-R63 R70 R71 R80 R81A R81B R82 R90-R93 RB0 RD1 RD2 RISO RV1 RV2 = RR0603: GateName_1: G$1; SymbolName_1: R; DeviceName: R0603; LibraryName: myrcl; DeviceSetName: R
R?#1-R?#6 = 0402 0Ω (0R0) 1%: 贴片电阻; ComponentLink1Description: 供应商链接; ComponentLink1URL: http://www.szlcsc.com/product/details_17853.html; Package: 0402; Supplier: LC; SuppliersPartNumber: C17168
SISO_CTRL SISO_UART = ISO7021: GateName_1: G$1; SymbolName_1: ISO7021; LibraryName: iso7021; DeviceSetName: ISO7021
U$1 = NR_FIELD: GateName_1: G$1; SymbolName_1: NR_FIELD; LibraryName: logo; DeviceSetName: NR_FIELD; NRFIELD: NRFIELD
U$2 = GND_MERGE: GateName_1: G$1; SymbolName_1: GND_MERGE; LibraryName: gnd_merge; DeviceSetName: GND_MERGE; merge: merge